# EAGLE design PanTiltCtlBoard (EAGLE 9.6.2)
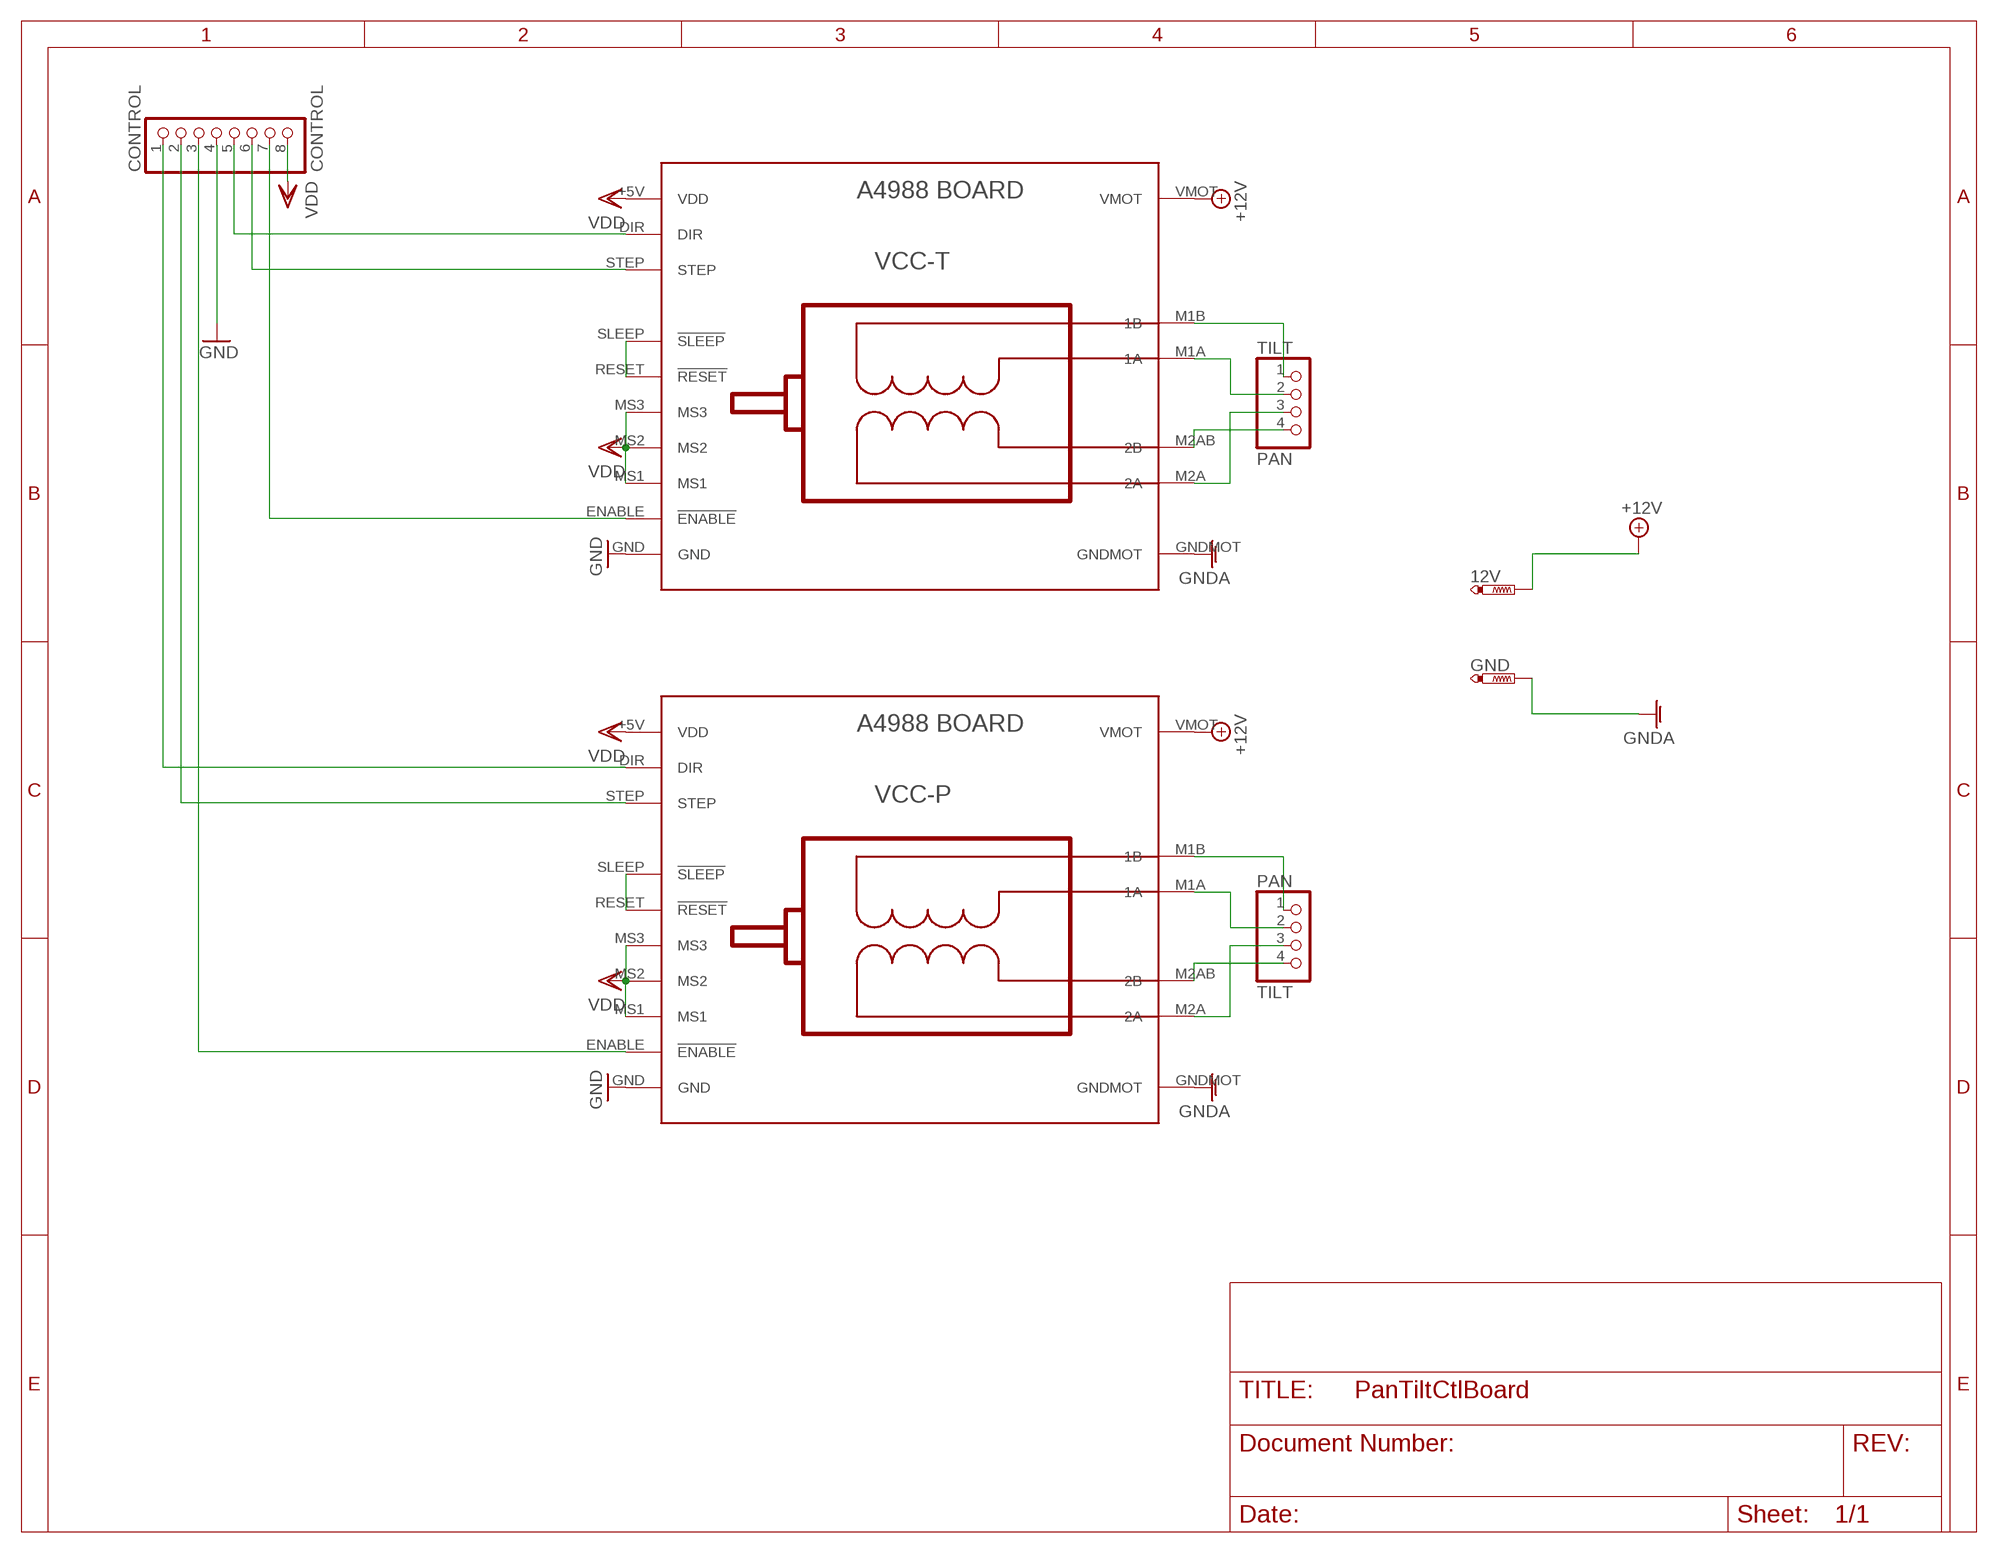
[diagram p0: schematic, sheet 1]

## Parts
12V  PTR1PAD1-13Y  [P1-13Y]
CONTROL  CONTROL  PINHD-1X8  [1X08]
GND  PTR1PAD1-13Y  [P1-13Y]
PAN  TILT  PINHD-1X4  [1X04]
TILT  PAN  PINHD-1X4  [1X04]
VCC-P  BOARD_A4988  [BOARD_A4988]
VCC-T  BOARD_A4988  [BOARD_A4988]

## Nets
+12V: 12V.TP VCC-P.VMOT VCC-T.VMOT
GND: CONTROL.4 VCC-P.GND VCC-T.GND
GNDA: GND.TP VCC-P.GNDMOT VCC-T.GNDMOT
N$1: TILT.4 VCC-T.M2AB(2B)
N$2: VCC-T.RESET(!RESET) VCC-T.SLEEP(!SLEEP)
N$3: CONTROL.7 VCC-T.ENABLE(!ENABLE)
N$4: CONTROL.6 VCC-T.STEP
N$5: CONTROL.5 VCC-T.DIR
N$6: CONTROL.1 VCC-P.DIR
N$7: CONTROL.2 VCC-P.STEP
N$8: CONTROL.3 VCC-P.ENABLE(!ENABLE)
N$9: VCC-P.RESET(!RESET) VCC-P.SLEEP(!SLEEP)
N$10: TILT.3 VCC-T.M2A(2A)
N$11: TILT.1 VCC-T.M1B(1B)
N$12: TILT.2 VCC-T.M1A(1A)
N$13: PAN.4 VCC-P.M2AB(2B)
N$14: PAN.3 VCC-P.M2A(2A)
N$15: PAN.1 VCC-P.M1B(1B)
N$18: PAN.2 VCC-P.M1A(1A)
VDD: CONTROL.8 VCC-P.+5V(VDD) VCC-P.MS1 VCC-P.MS2 VCC-P.MS3 VCC-T.+5V(VDD) VCC-T.MS1 VCC-T.MS2 VCC-T.MS3

## Library data of the parts
12V GND = testpad:PTR1: TEST PIN
CONTROL = pinhead:PINHD-1X8: PIN HEADER
PAN TILT = pinhead:PINHD-1X4: PIN HEADER
VCC-P VCC-T = Clean-Kong:BOARD_A4988

## Board
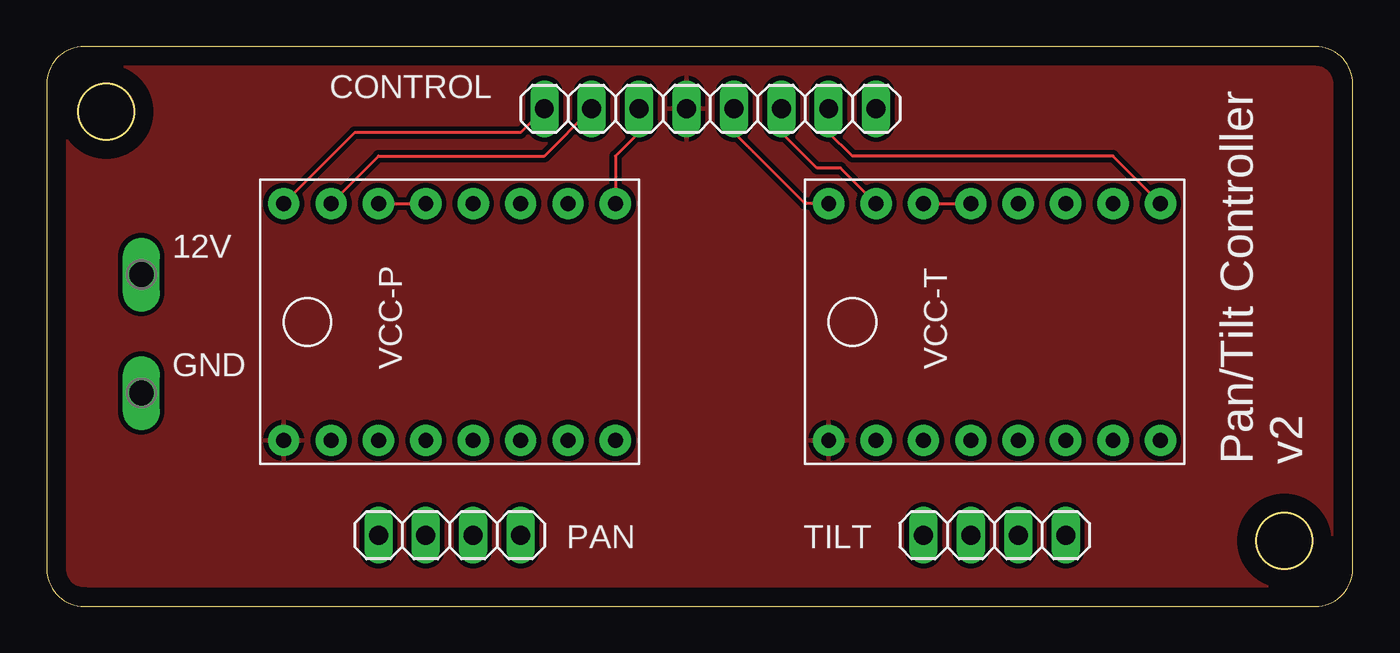
[diagram p1: board, top side]
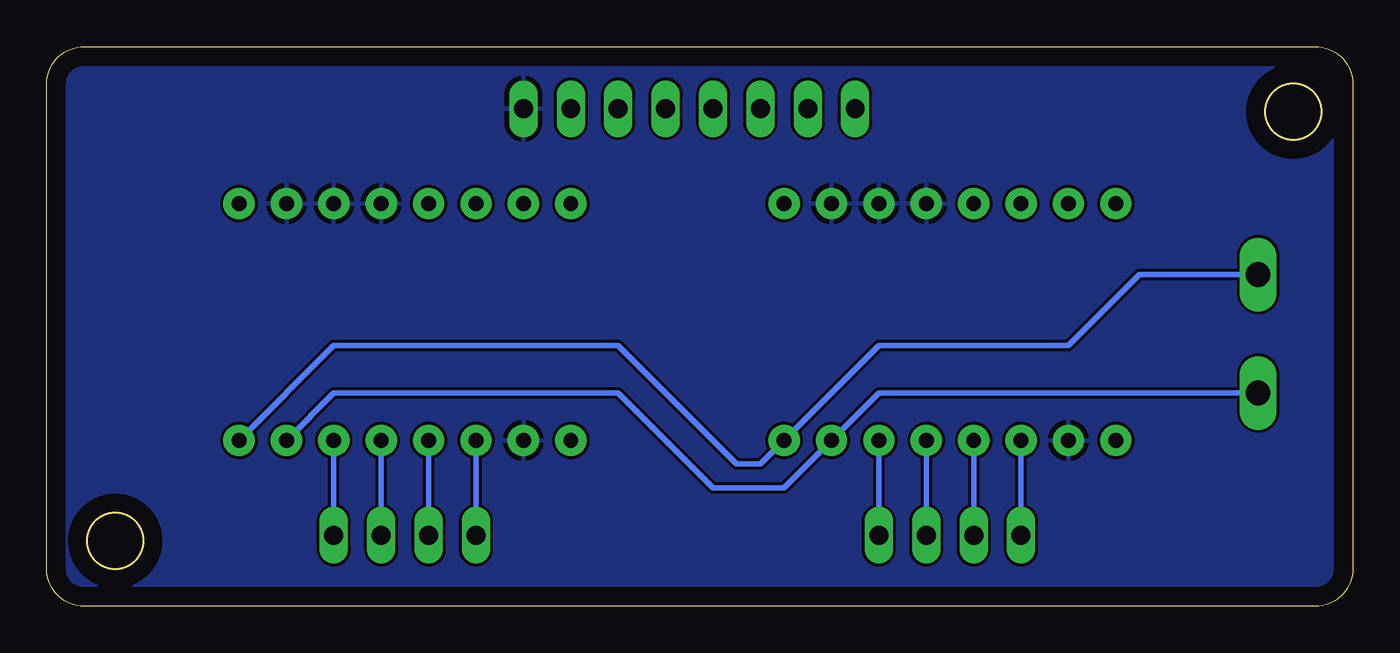
[diagram p2: board, bottom side, seen from below]

Size 70 x 30 mm. Coordinates in mm from the lower left corner, seen from the top.
Outline: 0,2 arc90 2,0 68,0 arc90 70,2 70,28 arc90 68,30 2,30 arc90 0,28 0,2
Outline: circle at 3.2,26.51 radius 1.5
Outline: circle at 66.33,3.51 radius 1.5
Copper layers (1*16): Top 0.035mm / dielectric 1.5mm / Bottom 0.035mm
Design rules "default": minimum track width 6mil, minimum drill 0.35mm, track to track 6mil, track to pad 6mil, pad to pad 6mil, via to via 6mil, smd to smd 6mil, copper to edge 40mil, drill to drill 6mil, minimum pad ring 10mil, minimum via ring 8mil, stop-mask expansion 4mil, vias tented up to drill 0mil, thermal gap 10mil

### Footprints (pad centres in the part's own frame; a part is rotated, then mirrored left to right if it is on the bottom)
P1-13Y = drill 1.321 pad 1.905 long: TP 0,0
1X08 = drill 1.016 long: 1 -8.89,0; 2 -6.35,0; 3 -3.81,0; 4 -1.27,0; 5 1.27,0; 6 3.81,0; 7 6.35,0; 8 8.89,0
1X04 = drill 1.016 long: 1 -3.81,0; 2 -1.27,0; 3 1.27,0; 4 3.81,0
BOARD_A4988 = drill 0.8 pad 1.676: +5V 1.27,16.51; DIR 13.97,19.05; ENABLE 13.97,1.27; GND 1.27,19.05; GNDMOT 1.27,3.81; M1A 1.27,11.43; M1B 1.27,13.97; M2A 1.27,8.89; M2AB 1.27,6.35; MS1 13.97,3.81; MS2 13.97,6.35; MS3 13.97,8.89; RESET 13.97,11.43; SLEEP 13.97,13.97; STEP 13.97,16.51; VMOT 1.27,1.27

### Placement (x,y rotation side)
12V  5.08,17.78 0 top
CONTROL  35.56,26.67 0 top
GND  5.08,11.43 0 top
PAN  21.59,3.81 0 top
TILT  50.8,3.81 0 top
VCC-P  31.75,7.62 90 top
VCC-T  60.96,7.62 90 top

### Tracks (layer width: path | path; a pad name or v marks a point on that pad's centre or on a via)
+12V
  Bottom 0.305: 12V.TP 11.43,17.78 15.24,13.97 25.4,13.97 VCC-P.VMOT 31.75,7.62 33.02,7.62 39.37,13.97 54.61,13.97 VCC-T.VMOT
GND
  pour Top (isolate 0.254): 0,0 69.85,0 69.85,30.48 0,30.48
GNDA
  Bottom 0.305: GND.TP 25.4,11.43 VCC-P.GNDMOT 30.48,6.35 34.29,6.35 39.37,11.43 54.61,11.43 VCC-T.GNDMOT
N$1
  Bottom 0.305: VCC-T.M2AB TILT.4
N$2
  Top 0.152: VCC-T.SLEEP VCC-T.RESET
N$3
  Top 0.152: VCC-T.ENABLE 57.15,24.13 43.18,24.13 41.91,25.4 CONTROL.7
N$4
  Top 0.152: VCC-T.STEP 42.55,23.5 41.27,23.5 39.37,25.4 CONTROL.6
N$5
  Top 0.152: VCC-T.DIR 40.64,21.59 36.83,25.4 CONTROL.5
N$6
  Top 0.152: CONTROL.1 25.4,25.4 16.51,25.4 VCC-P.DIR
N$7
  Top 0.152: VCC-P.STEP 17.78,24.13 26.67,24.13 CONTROL.2
N$8
  Top 0.152: VCC-P.ENABLE 30.48,24.13 31.75,25.4 CONTROL.3
N$9
  Top 0.152: VCC-P.SLEEP VCC-P.RESET
N$10
  Bottom 0.305: VCC-T.M2A TILT.3
N$11
  Bottom 0.305: VCC-T.M1B TILT.1
N$12
  Bottom 0.305: VCC-T.M1A TILT.2
N$13
  Bottom 0.305: VCC-P.M2AB PAN.4
N$14
  Bottom 0.305: VCC-P.M2A PAN.3
N$15
  Bottom 0.305: VCC-P.M1B PAN.1
N$18
  Bottom 0.305: VCC-P.M1A PAN.2
VDD
  pour Bottom: 0,0 68.58,0 69.85,1.27 69.85,27.94 69.85,29.21 68.58,30.48 1.27,30.48 0,29.21

### Text on the board
tPlace: Pan/Tilt Controller / v2